# Altium schematic sheet mPCIe_Breakout01_SCH-PAGE3_POWER_SUPPLY.SchDoc: SWARM GATEWAY MCU
size Tabloid; PageSetup: Record=PageOptions|CenterHorizontal=True|CenterVertical=True|PrintScale=0.61|XCorrection=1.00|YCorrection=1.00|PrintKind=1|BorderSize=5000000|LeftOffset=0|BottomOffset=0|Orientation=2|PaperLength=1000|PaperWidth=1000|Scale=100|PaperSource=7|PrintQuality=-4|MediaType=1|DitherType=10|PaperKind=Letter (8.5" x 11")|PrintScaleMode=1; DocumentNumber: 3; SheetNumber: 3; SheetTotal: 3; SheetName: Swarm Embedded Gateway MCU
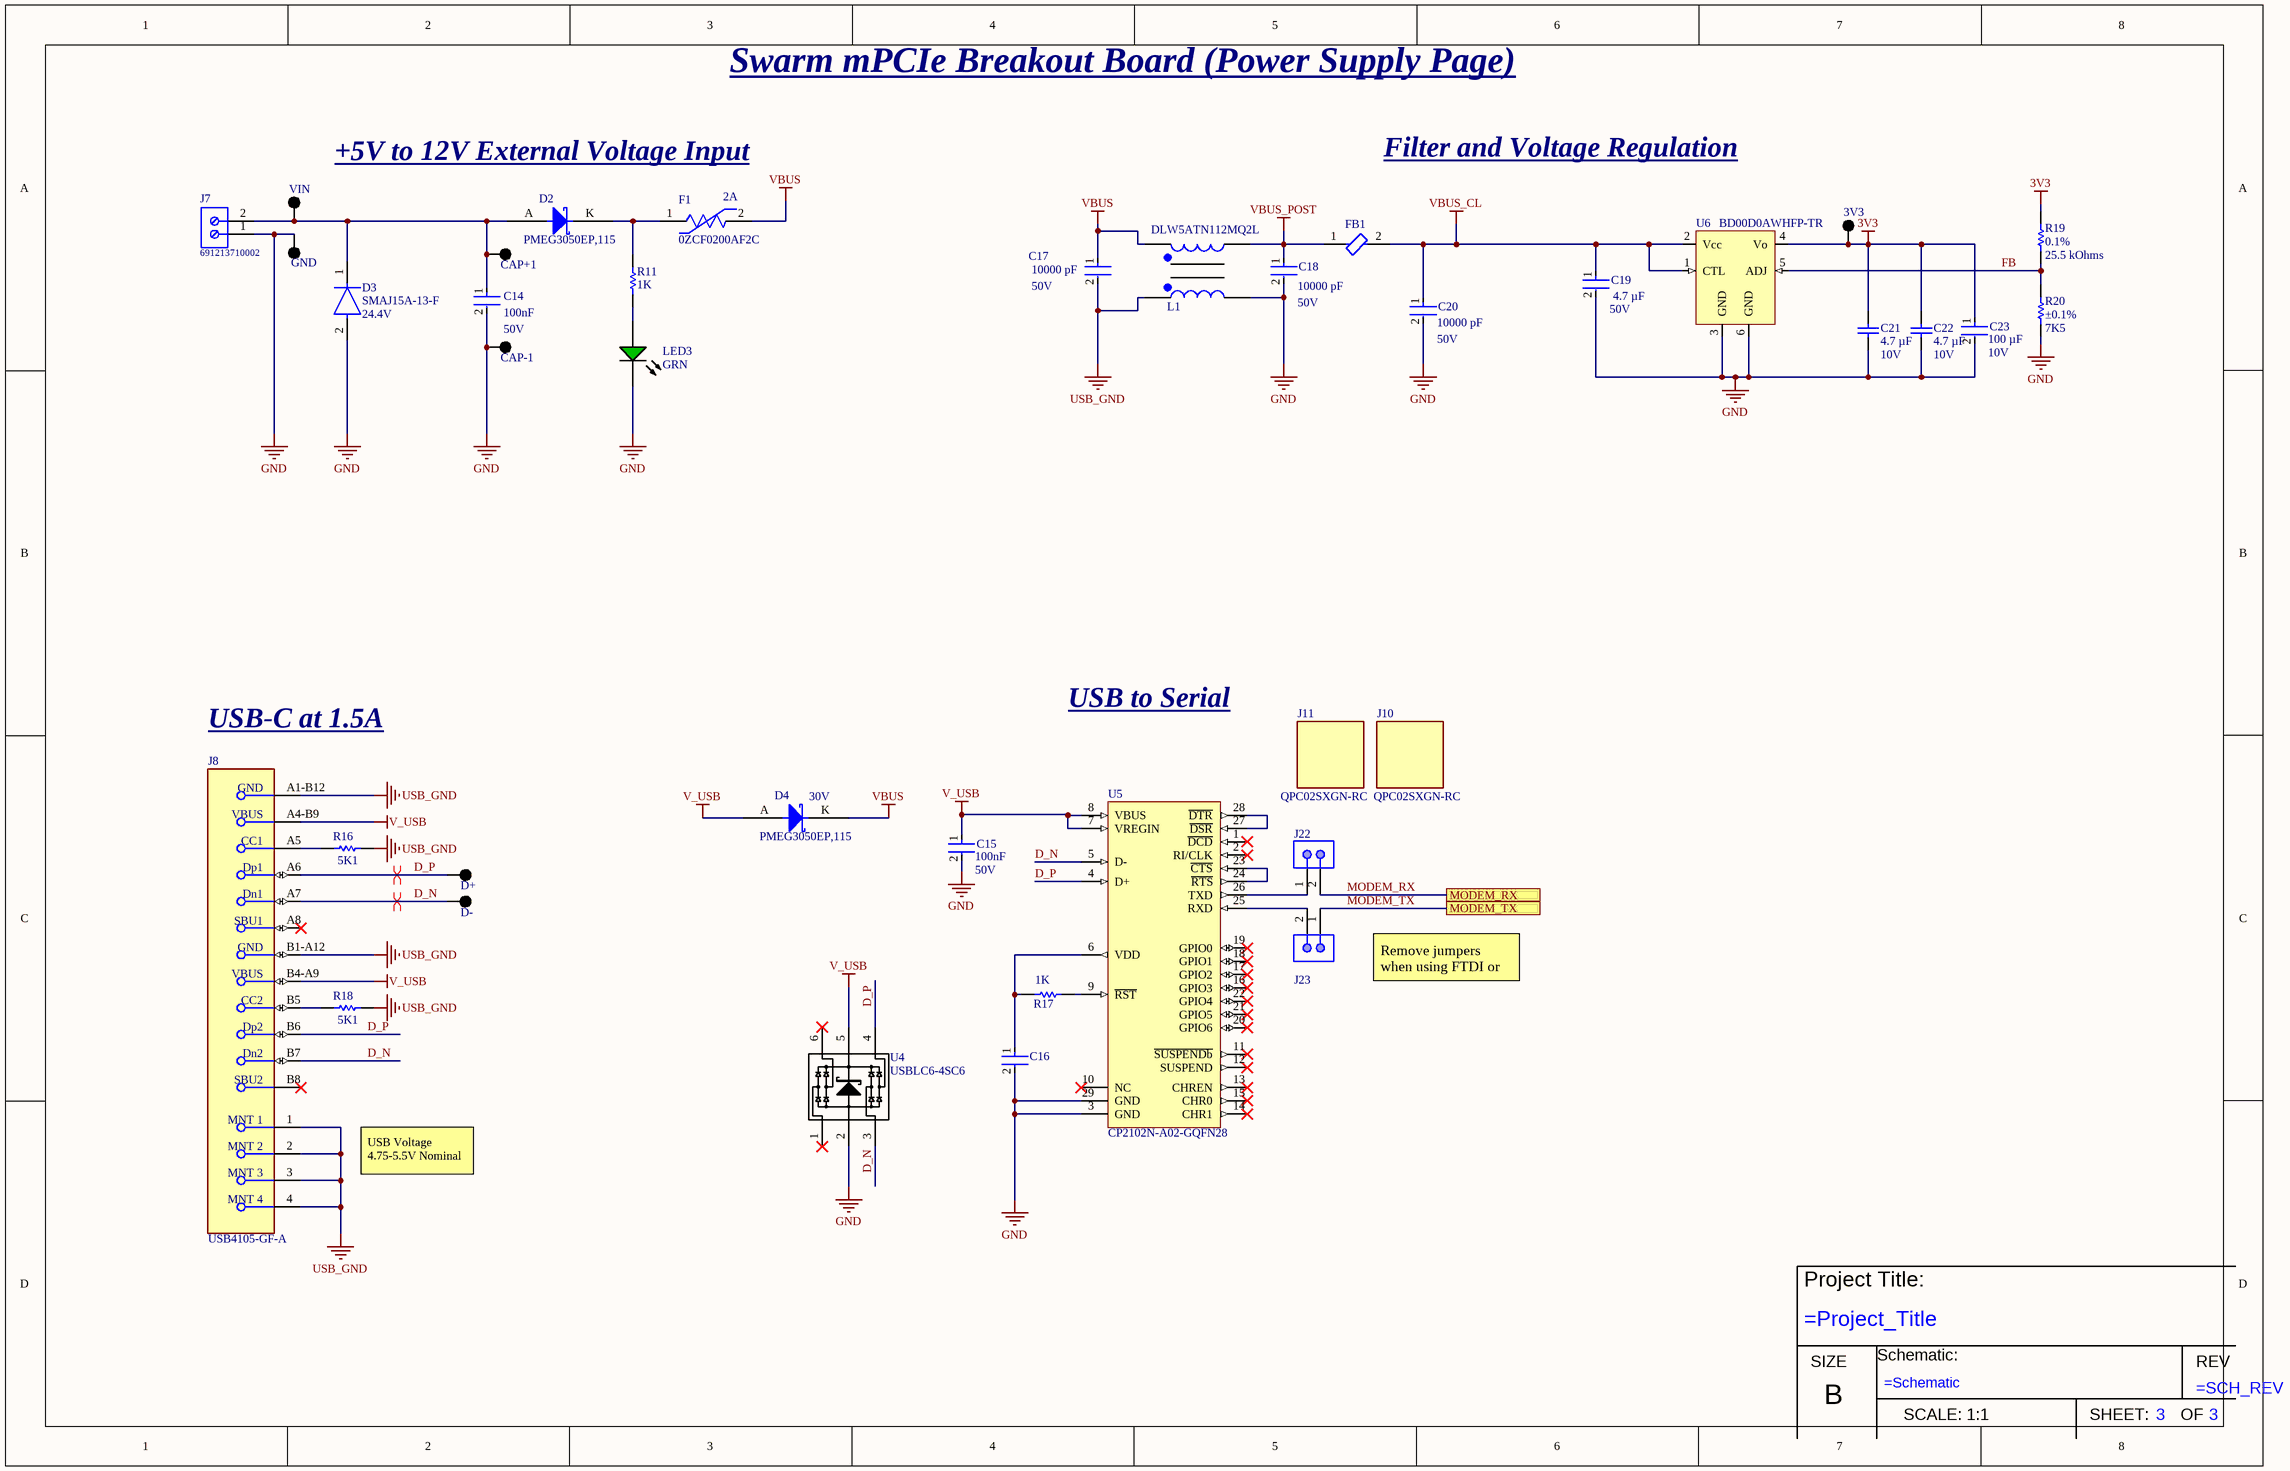
[diagram p0: mPCIe_Breakout01_SCH-PAGE3_POWER_SUPPLY.SchDoc]

## Parts
3V3  5001  [KSTN-5001]  (value not drawn)
?  TitleBlock_SpaceX  (value not drawn)  (graphical)
C14  value 100nF  Voltage: 50V  [FP-CL10-0_1-MFG]  (hidden comment: CGA3E2X7R1H104K080AA)
C15  value 100nF  Voltage: 50V  [FP-CL10-0_1-MFG]  (hidden comment: CGA3E2X7R1H104K080AA)
C16  CGA3E2X7R1H104K080AA  [FP-CL10-0_1-MFG]  (value not drawn)
C17  value 10000 pF  Voltage: 50V  [FP-GRM219-0_1-IPC_B]  (hidden comment: GRM2195C1H103JA01D)
C18  value 10000 pF  Voltage: 50V  [FP-GRM219-0_1-IPC_B]  (hidden comment: GRM2195C1H103JA01D)
C19  value 4.7 µF  Voltage: 50V  [FP-GRM31C-0_2-e0_3_0_8-IPC_C]  (hidden comment: GRM31CR71H475KA12L)
C20  value 10000 pF  Voltage: 50V  [FP-GRM219-0_1-IPC_B]  (hidden comment: GRM2195C1H103JA01D)
C21  value 4.7 µF  Voltage: 10V  [CAPC2013X135X45LL10T25]  (hidden comment: GRM21BR71A475KA73L)
C22  value 4.7 µF  Voltage: 10V  [CAPC2013X135X45LL10T25]  (hidden comment: GRM21BR71A475KA73L)
C23  value 100 µF  Voltage: 10V  [FP-GRM32E-0_3-0_2-IPC_B]  (hidden comment: GRM32ER61A107ME20L)
CAP+1  5001  [KSTN-5001]  (value not drawn)
CAP-1  5001  [KSTN-5001]  (value not drawn)
D2  PMEG3050EP,115  [SODFL620X110-2N]
D3  Voltage: 24.4V  [FP-SMA-MFG]  (hidden comment: SMAJ15A-13-F)
D4  Voltage: 30V  [SODFL620X110-2N]  (hidden comment: PMEG3050EP,115)
D+  5001  [KSTN-5001]  (value not drawn)
D-  5001  [KSTN-5001]  (value not drawn)
F1  0ZCF0200AF2C  value 2A  [FP-0ZCF0200AF2C-MFG]
FB1  BLM21SP601SH1D  [FP-BLM21-0_2-t0_85-e0_5-d-IPC_A]  (value not drawn)
GND  5001  [KSTN-5001]  (value not drawn)
J7  691213710002  [691213710002]
J8  USB4105-GF-A  [FP-USB4105-GF-A-MFG]
J10  QPC02SXGN-RC  [FP-QPC02SXGN-RC-MFG]
J11  QPC02SXGN-RC  [FP-QPC02SXGN-RC-MFG]
J22  TSW-102-07-S-S  [SMTC-TSW-102-07-S-S]  (value not drawn)
J23  TSW-102-07-S-S  [SMTC-TSW-102-07-S-S]  (value not drawn)
L1  DLW5ATN112MQ2L  [FIL_DLW5ATN112MQ2L]
LED3  value GRN  [WE-150060VS75000_V]  (hidden comment: 150060VS75000)
R11  value 1K  [RESC1608X55X30LL20T20]  (hidden comment: ERA3AEB102V)
R16  value 5K1  [RESC2013X70X40LL20T20]  (hidden comment: ERJ6ENF5101V)
R17  value 1K  [RESC1608X55X30LL20T20]  (hidden comment: ERA3AEB102V)
R18  value 5K1  [RESC2013X70X40LL20T20]  (hidden comment: ERJ6ENF5101V)
R19  value 25.5 kOhms  Tolerance: 0.1%  [RESC1608X50X30LL20T20]  (hidden comment: RG1608P-2552-B-T5)
R20  value 7K5  Tolerance: ±0.1%  [RESC1608X55X30LL20T20]  (hidden comment: ERA3AEB102V)
U4  USBLC6-4SC6  [SM/SOT23-6PIN]
U5  CP2102N-A02-GQFN28  [QFN50P500X500X100_HS-29N]
U6  BD00D0AWHFP-TR  [TO172P1054X2005-6N]
VIN  5001  [KSTN-5001]  (value not drawn)

## Ports
MODEM_RX, MODEM_TX

## Nets
3V3: 3V3.1 C21.2 C22.2 C23.1 R19.2 U6.4(Vo)
GND: C14.2 C15.2 C16.2 C18.2 C19.2 C20.2 C21.1 C22.1 C23.2 CAP-1.1 D3.2(A) GND.1 J7.1 L1.3 LED3.1(K) R20.1 U4.2(GND) U5.3(GND) U5.29(GND) U6.3(GND) U6.6(GND)
USB_GND: C17.2 J8.1(MNT_1) J8.2(MNT_2) J8.3(MNT_3) J8.4(MNT_4) J8.A1-B12(GND) J8.B1-A12(GND) L1.4 R16.2 R18.2
V_USB: C15.1 D4.A J8.A4-B9(VBUS) J8.B4-A9(VBUS) U4.5(VBUS) U5.7(VREGIN) U5.8(VBUS)
VBUS: C17.1 D4.K F1.2 L1.1
VBUS_CL: C19.1 C20.1 FB1.2 U6.1(CTL) U6.2(Vcc)
VBUS_POST: C18.1 FB1.1 L1.2
D_N: D-.1 J8.A7(Dn1) J8.B7(Dn2) U4.3(P2) U5.5(D-)
D_P: D+.1 J8.A6(Dp1) J8.B6(Dp2) U4.4(P3) U5.4(D+)
FB: R19.1 R20.2 U6.5(ADJ)
MODEM_RX: J22.2 ; port MODEM_RX
MODEM_TX: J23.1 ; port MODEM_TX
NetC14_1: C14.1 CAP+1.1 D2.A D3.1(C) J7.2 VIN.1
NetC16_1: C16.1 R17.1 U5.6(VDD)
NetD2_K: D2.K F1.1 R11.2
NetJ8_A5: J8.A5(CC1) R16.1
NetJ8_B5: J8.B5(CC2) R18.1
NetJ22_1: J22.1 U5.26(TXD)
NetJ23_2: J23.2 U5.25(RXD)
NetLED3_2: LED3.2(A) R11.1
NetR17_2: R17.2 U5.9(~{RST})
NetU5_23: U5.23(~{CTS}) U5.24(~{RTS})
NetU5_27: U5.27(~{DSR}) U5.28(~{DTR})

Not connected (* = marked no-connect by the designer): J8 A8(SBU1)* B8(SBU2)*; U4 1(P1)* 6(P4)*; U5 1(~{DCD})* 2(RI/CLK)* 10(NC)* 11(~{SUSPENDb})* 12(SUSPEND)* 13(CHREN)* 14(CHR1)* 15(CHR0)* 16(GPIO3)* 17(GPIO2)* 18(GPIO1)* 19(GPIO0)* 20(GPIO6)* 21(GPIO5)* 22(GPIO4)*

## Layout directives
differential pair: D_N, D_P

## Notes on the sheet
- Swarm mPCIe Breakout Board (Power Supply Page)
- +5V to 12V External Voltage Input
- Filter and Voltage Regulation
- USB-C at 1.5A
- USB to Serial
- Remove jumpers when using FTDI or RS232
- USB Voltage 4.75-5.5V Nominal
- (in symbol TitleBlock_SpaceX) Project Title:; Schematic:; SIZE; REV; B; SCALE: 1:1; SHEET:       OF

## Library data of the parts
3V3 CAP+1 CAP-1 D+ D- GND VIN = CMP-2000-05181-1: Test Point, Black, 1-Pin THD, RoHS, Bulk; Manufacturer: Keystone Electronics; TEMP: NA; Value: NA; Type: TEST POINT; Manufacturer Part Number: 5001; MANUF1: Keystone Electronics; MANUF1 P/N: 5001; Size: TH; SPECIAL_INSTRUCTIONS: 5001; Supplier: Digikey; Supplier P/N: 36-5001-ND; Tolerance: NA; Voltage: NA
? = TitleBlock_SpaceX: TITLE
C14-C16 = CMP-13271-000011-1: Cap Ceramic 100nF 50V X7R 10% Pad SMD 0603 +125°C Automotive T/R; Manufacturer: TDK; TEMP: -55°C ~ 125°C; Manufacturer Part Number: CGA3E2X7R1H104K080AA; Tolerance: 10%; MANUF1: TDK; MANUF1 P/N: CGA3E2X7R1H104K080AA; Size: 0603; SPECIAL_INSTRUCTIONS: CGA3E2X7R1H104K080AA; Supplier: Digi-Key; Supplier P/N: 1276-1033-2-ND; Type: CAP
  C16: Value: 100nF; Voltage: 50V
C17 C18 C20 = CMP-2007-00135-2: Chip Multilayer Ceramic Capacitors for General Purpose, 0805, 10000pF, C0G, 30ppm/°C, 5%, 50V; Manufacturer: Murata; TEMP: -55°C ~ 125°C; Type: CAP; Tolerance: 5%; Manufacturer Part Number: GRM2195C1H103JA01D; MANUF1: Murata; MANUF1 P/N: GRM2195C1H103JA01D; Size: 0805; SPECIAL_INSTRUCTIONS: GRM2195C1H103JA01D; Supplier: Digi-Key; Supplier P/N: 490-1642-2-ND
C19 = CMP-1037-04923-3: Chip Multilayer Ceramic Capacitors for General Purpose, 1206, 4.7uF, X7R, 15%, 10%, 50V; Manufacturer: TDK; Manufacturer Part Number: C3216X5R1H475K; TEMP: 445-5994-2-ND; Type: CAP; Tolerance: 10%; MANUF1: TDK; MANUF1 P/N: C3216X5R1H475K; Size: 1206; SPECIAL_INSTRUCTIONS: C3216X5R1H475K; Supplier: Digi-Key; Supplier P/N: C3216X5R1H475K
C21 C22 = CMP-2007-03555-1: 4.7 µF ±10% 10V Ceramic Capacitor X7R 0805 (2012 Metric); Manufacturer: Murata; TEMP: -55°C ~ 125°C; Type: CAP; Manufacturer Part Number: GRM21BR71A475KA73L; MANUF1: Murata; MANUF1 P/N: GRM21BR71A475KA73L; Size: 0805; SPECIAL_INSTRUCTIONS: GRM21BR71A475KA73L; Supplier: Digi-Key; Supplier P/N: 490-6480-2-ND; Tolerance: 10%
C23 = CMP-06035-048205-1: Chip Multilayer Ceramic Capacitors for General Purpose, 1210, 100uF, X5R, 15%, 20%, 10V; Manufacturer: Murata; TEMP: -55°C ~ 85°C; Type: CAP; Tolerance: 20%; Manufacturer Part Number: GRM32ER61A107ME20L; MANUF1: Murata; MANUF1 P/N: GRM32ER61A107ME20L; Size: 1210; SPECIAL_INSTRUCTIONS: GRM32ER61A107ME20L; Supplier: Digi-Key; Supplier P/N: 490-9969-2-ND
D2 D4 = PMEG3050EP,115: DIODE SCHOTTKY 30V 5A SOD128; MANUF1: NXP Semiconductors; Tolerance: NA; TEMP: -55°C ~ 175°C; 1K COST: .28; Size: SOD-128; Value: 5A; Supplier: Digikey; Supplier P/N: 1727-5317-1-ND; Type: DIODE; SPECIAL_INSTRUCTIONS: PMEG3050EP,115; MANUF1 P/N: PMEG3050EP,115; Manufacturer: NXP Semiconductors; Manufacturer Part Number: PMEG3050EP,115
  D2: Voltage: 30V
D3 = CMP-12828-000004-1: TVS DIODE 15V 24.4V SMA; Manufacturer: Diodes; TEMP: -50°C ~ 150°C; Tolerance: NA; Value: NA; Manufacturer Part Number: SMAJ15A-13-F; MANUF1: Diodes; MANUF1 P/N: SMAJ15A-13-F; Size: SMA; SPECIAL_INSTRUCTIONS: SMAJ15A-13-F; Supplier: Digikey; Supplier P/N: SMAJ15A-FDITR-ND; Type: DIODE
F1 = CMP-16043-000006-1: PTC RESET FUSE 24V 2A 2920; Manufacturer: Bel; TEMP: -40°C ~ 85°C; Tolerance: NA; Manufacturer Part Number: 0ZCF0200AF2C; MANUF1: Bel; MANUF1 P/N: 0ZCF0200AF2C; Size: 2920; SPECIAL_INSTRUCTIONS: 0ZCF0200AF2C; Supplier: Digikey; Supplier P/N: 507-1749-2-ND; Type: FUSE; Voltage: 24V
FB1 = CMP-06046-001905-1: Chip Ferrite Bead, 0805, 600Ω @ 100MHz, 0.06Ω, 25%, 2.3A; Manufacturer: Murata; TEMP: -55°C ~ 125°C; Tolerance: NA; Value: 600 Ohms @ 100 MHz; Manufacturer Part Number: BLM21SP601SH1D; MANUF1: Murata; MANUF1 P/N: BLM21SP601SH1D; Size: 0805; SPECIAL_INSTRUCTIONS: BLM21SP601SH1D; Supplier: Digi-Key; Supplier P/N: 490-18588-2-ND; Type: FERRITE; Voltage: NA
J7 = 691213710002: HEADER, 2 Position Wire to Board Terminal Block Horizontal with Board 0.197" (5.00mm) Through Hole; MANUF1: Wurth Electronics Inc.; 1K COST: .68; TEMP: -40°C ~ 105°C; Value: Green; Voltage: 300V; MANUF1 P/N: 691213710002; Size: 5mm; SPECIAL_INSTRUCTIONS: 691213710002; Supplier: Digikey; Supplier P/N: 732-2038-ND; Tolerance: n/a; Type: Wire to Board; Manufacturer: Wurth Electronics Inc.; Manufacturer Part Number: 691213710002
J8 = CMP-245163-000001-1: CONN RCPT USB2.0 TYPEC 5A; Manufacturer: Global Connector Technology; TEMP: -40°C ~ 85°C; Tolerance: NA; Value: NA; Manufacturer Part Number: USB4105-GF-A; MANUF1: Global Connector Technology; MANUF1 P/N: USB4105-GF-A; Size: SMT/TH; SPECIAL_INSTRUCTIONS: USB4105-GF-A; Supplier: Digikey; Supplier P/N: 2073-USB4105-GF-ATR-ND; Type: CONN; Voltage: NA
J10 J11 = CMP-25666-000001-1: CONN JUMPER SHORTING .100" GOLD; Manufacturer: Sullins; TEMP: -40°C ~ 85°C; Tolerance: NA; Value: 3A; Manufacturer Part Number: QPC02SXGN-RC; MANUF1: Sullins; MANUF1 P/N: QPC02SXGN-RC; Size: 2.54MM; SPECIAL_INSTRUCTIONS: QPC02SXGN-RC; Supplier: Digi-Key; Supplier P/N: S9337-ND; Type: JUMPER; Voltage: NA
J22 J23 = CMP-1681-00004-4: Male Header, Pitch 2.54 mm, 1 x 2 Position, Height 8.38 mm, Tail Length 2.54 mm, -55 to 125 degC, RoHS, Bulk; Manufacturer: Samtec; TEMP: -55°C ~ 125°C; Tolerance: NA; Value: NA; Manufacturer Part Number: TSW-102-07-S-S; MANUF1: Samtec; MANUF1 P/N: TSW-102-07-S-S; Size: TH; SPECIAL_INSTRUCTIONS: TSW-102-07-S-S; Supplier: Digi-Key; Supplier P/N: SAM1033-02-ND; Type: CONN; Voltage: NA
L1 = CM_Choke_DLW5ATN112MQ2L: CMC 2A 2LN 1.1 KOHM SMD; MANUF1: Murata Electronics; Tolerance: NA; Type: CMCCC; TEMP: -40°C ~ 105°C; 1K COST: 0.68; Size: SMT; SPECIAL_INSTRUCTIONS: DLW5ATN112MQ2L; Supplier: Digikey; Supplier P/N: 490-12641-2-ND; MANUF1 P/N: DLW5ATN112MQ2L; Value: 2A; Voltage: N/A; Manufacturer: Murata Electronics; Manufacturer Part Number: DLW5ATN112MQ2L
LED3 = CMP-1426-00006-4: WL-SMCW SMD Chip LED Top View Monocolor Waterclear, 30 mA, 2 V, -40 to 85 degC, 2-Pin SMD, RoHS, Tape and Reel GRN; Manufacturer: Wurth Electronics; TEMP: 40 up to +85 °C; Tolerance: NA; Voltage: 25V; Manufacturer Part Number: 150060VS75000; MANUF1: Wurth Electronics; MANUF1 P/N: 150060VS75000; Size: 0603; SPECIAL_INSTRUCTIONS: 150060VS75000; Supplier: Digi-Key; Supplier P/N: 732-4980-2-ND; Type: LED
R11 R17 = CMP-2000-00873-1: RES SMD 1K OHM 0.1% 1/10W 0603; Manufacturer: Panasonic; Manufacturer Part Number: ERA-3AEB102V; TEMP: -55°C ~ 155°C; Voltage: NA; MANUF1: Panasonic; MANUF1 P/N: ERA-3AEB102V; Size: 0603; SPECIAL_INSTRUCTIONS: ERA-3AEB102V; Supplier: Digi-Key; Supplier P/N: P1.0KDBTR-ND; Tolerance: ±0.1%; Type: RES
R16 R18 = CMP-2001-00553-1: RES SMD 5.1K OHM 1% 1/8W 0805; Manufacturer: Panasonic; Manufacturer Part Number: ERJ-6ENF5101V; TEMP: -55°C ~ 155°C; Voltage: NA; MANUF1: Panasonic; MANUF1 P/N: ERJ-6ENF5101V; Size: 0603; SPECIAL_INSTRUCTIONS: ERJ-6ENF5101V; Supplier: Digi-Key; Supplier P/N: P5.10KCTR-ND; Tolerance: ±1%; Type: RES
R19 = CMP-2000-02146-1: RES SMD 25.5KOHM 0.1% 1/10W 0603; Manufacturer: Susumu; TEMP: -55°C ~ 125°C; Voltage: NA; Manufacturer Part Number: RG1608P-2552-B-T5; MANUF1: Susumu; MANUF1 P/N: RG1608P-2552-B-T5; Size: 0603; SPECIAL_INSTRUCTIONS: RG1608P-2552-B-T5; Supplier: Digi-Key; Supplier P/N: RG16P25.5KBTR-ND; Type: RES
R20 = CMP-2000-00873-1_1: RES SMD 7.5K OHM 0.1% 1/10W 0603; Manufacturer: Panasonic; Manufacturer Part Number: ERA-3AEB752V; TEMP: -55°C ~ 155°C; Voltage: NA; MANUF1: Panasonic; MANUF1 P/N: ERA-3AEB752V; Size: 0603; SPECIAL_INSTRUCTIONS: ERA-3AEB752V; Supplier: Digi-Key; Supplier P/N: P7.5KDBTR-ND; Type: RES
U4 = USBLC6-4: USB ESD PROTECTION; MANUF1: STMicroelectronics; TEMP: -40°C ~ 125°C; 1K COST: 0.17903; MANUF1 P/N: USBLC6-4SC6; Size: SOT-23-6; SPECIAL_INSTRUCTIONS: USBLC6-4SC6; Supplier: Digi-Key; Supplier P/N: 497-4492-2-ND; Tolerance: N/A; Type: N/A; Value: N/A; Voltage: N/A; Manufacturer: STMicroelectronics; Manufacturer Part Number: USBLC6-4SC6
U5 = CP2102N-A02-GQFN28: USB Bridge, USB to UART USB 2.0 UART Interface 28-QFN (5x5); MANUF1: Silicon Labs; 1K COST: 1.22; TEMP: -40°C ~ 85°C; Size: QFN-28; SPECIAL_INSTRUCTIONS: CP2102N-A02-GQFN28; Supplier: Digi-Key; Supplier P/N: 336-5890-2-ND; Tolerance: N/A; Type: IC; Value: N/A; Voltage: N/A; MANUF1 P/N: CP2102N-A02-GQFN28; Manufacturer: Silicon Labs; Manufacturer Part Number: CP2102N-A02-GQFN28
U6 = BD00D0AWHFP-TR: 2A Standard / Variable Output LDO Regulator; MANUF1: Rohm; TEMP: -40°C ~ 105°C; Tolerance: NA; Value: 0.55V @ 1A; Voltage: 25V; MANUF1 P/N: BD00D0AWHFP-TR; Manufacturer: Rohm; Manufacturer Part Number: BD00D0AWHFP-TR; Size: HRP-5; SPECIAL_INSTRUCTIONS: BD00D0AWHFP-TR; Supplier: Digi-Key; Supplier P/N: BD00D0AWHFPTR-ND; Type: IC